# Altium schematic sheet BV100011_ControlIsolator.SchDoc
size B
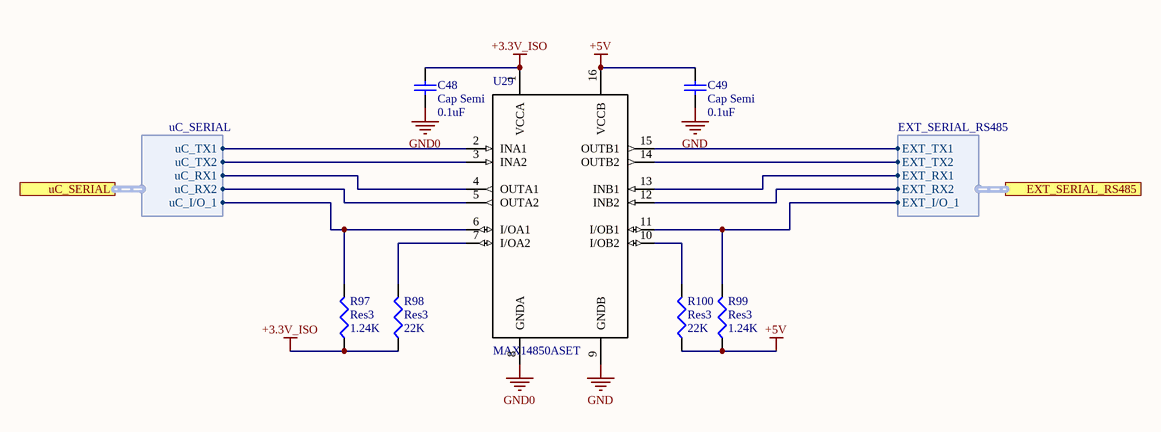
[diagram p0: BV100011_ControlIsolator.SchDoc]

## Parts
C48  Cap Semi  value 0.1uF  [C1206]
C49  Cap Semi  value 0.1uF  [C1206]
R97  Res3  value 1.24K  [J1-0603]
R98  Res3  value 22K  [J1-0603]
R99  Res3  value 1.24K  [J1-0603]
R100  Res3  value 22K  [J1-0603]
U29  MAX14850ASET  [*SOIC127P600X175-16N]

## Ports
EXT_SERIAL_RS485 (harness EXT_SERIAL_RS485), uC_SERIAL (harness uC_SERIAL)

## Harnesses
uC_SERIAL: uC_TX1, uC_TX2, uC_RX1, uC_RX2, uC_I/O_1
EXT_SERIAL_RS485: EXT_TX1, EXT_TX2, EXT_RX1, EXT_RX2, EXT_I/O_1

## Nets
+3.3V_ISO: C48.1 R97.1 R98.1 U29.1(VCCA)
+5V: C49.1 R99.1 R100.1 U29.16(VCCB)
GND: C49.2 U29.9(GNDB)
GND0: C48.2 U29.8(GNDA)
NetR97_2: R97.2 U29.6(I/OA1) ; port uC_SERIAL.uC_I/O_1
NetR98_2: R98.2 U29.7(I/OA2)
NetR99_2: R99.2 U29.11(I/OB1) ; port EXT_SERIAL_RS485.EXT_I/O_1
NetR100_2: R100.2 U29.10(I/OB2)
NetU29_2: U29.2(INA1) ; port uC_SERIAL.uC_TX1
NetU29_3: U29.3(INA2) ; port uC_SERIAL.uC_TX2
NetU29_4: U29.4(OUTA1) ; port uC_SERIAL.uC_RX1
NetU29_5: U29.5(OUTA2) ; port uC_SERIAL.uC_RX2
NetU29_12: U29.12(INB2) ; port EXT_SERIAL_RS485.EXT_RX2
NetU29_13: U29.13(INB1) ; port EXT_SERIAL_RS485.EXT_RX1
NetU29_14: U29.14(OUTB2) ; port EXT_SERIAL_RS485.EXT_TX2
NetU29_15: U29.15(OUTB1) ; port EXT_SERIAL_RS485.EXT_TX1

## Library data of the parts
C48 C49 = Cap Semi: Capacitor (Semiconductor SIM Model); Published: 8-Jun-2000; LatestRevisionDate: 29-May-2009; LatestRevisionNote: IPC-7351 Footprint Added.; PackageReference: C1206; Publisher: Altium Limited; PackageDescription: Chip Capacitor
R97-R100 = Res3: Resistor; Published: 8-Jun-2000; LatestRevisionDate: 29-May-2009; LatestRevisionNote: IPC-7351 Footprint Added.; PackageReference: J1-0603; Publisher: Altium Limited; PackageDescription: Chip Resistor
U29 = MAX14850ASET: Digital Isolator, 6-Ch, 30ns, Nsoic-16; MF: Maxim Integrated; MP: MAX14850ASE+; SnapEDA_Link: https://www.snapeda.com/parts/MAX14850ASE%2B/Maxim%20Integrated/view-part/?ref=snap; Availability: Unavailable; Price: None; Package: SOIC-16 Maxim; Value: *